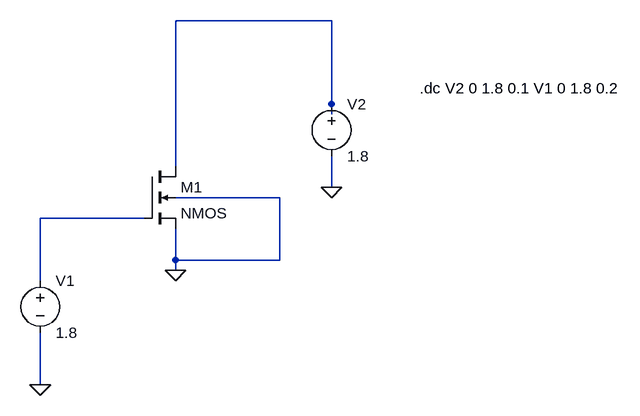
[diagram p0: schematic Draft4.asc]
Draft4.asc, the LTspice schematic file:
Version 4.1
SHEET 1 880 680
WIRE 192 -240 -48 -240
WIRE 192 -112 192 -240
WIRE 192 -96 192 -112
WIRE -48 -16 -48 -240
WIRE 192 16 192 -32
WIRE 112 32 -48 32
WIRE -96 64 -256 64
WIRE -48 128 -48 80
WIRE 112 128 112 32
WIRE 112 128 -48 128
WIRE -48 144 -48 128
WIRE -256 160 -256 64
WIRE -256 320 -256 240
FLAG -256 320 0
FLAG -48 144 0
FLAG 192 16 0
SYMBOL nmos4 -96 -16 R0
SYMATTR InstName M1
SYMATTR Value2 l=1080nm w=1080nm
SYMBOL voltage -256 144 R0
WINDOW 123 0 0 Left 0
WINDOW 39 0 0 Left 0
SYMATTR InstName V1
SYMATTR Value 1.8
SYMBOL voltage 192 -128 R0
WINDOW 123 0 0 Left 0
WINDOW 39 0 0 Left 0
SYMATTR InstName V2
SYMATTR Value 1.8
TEXT 328 -136 Left 2 !.dc V2 0 1.8 0.1 V1 0 1.8 0.2

The netlist it stands for:
* Draft4.asc
M1 N001 N002 0 0 NMOS l=1080nm w=1080nm
V1 N002 0 1.8
V2 N001 0 1.8
.model NMOS NMOS
.model PMOS PMOS
.lib standard.mos
.dc V2 0 1.8 0.1 V1 0 1.8 0.2
.backanno
.end